# EAGLE schematic RPI (EAGLE 9.6.2)
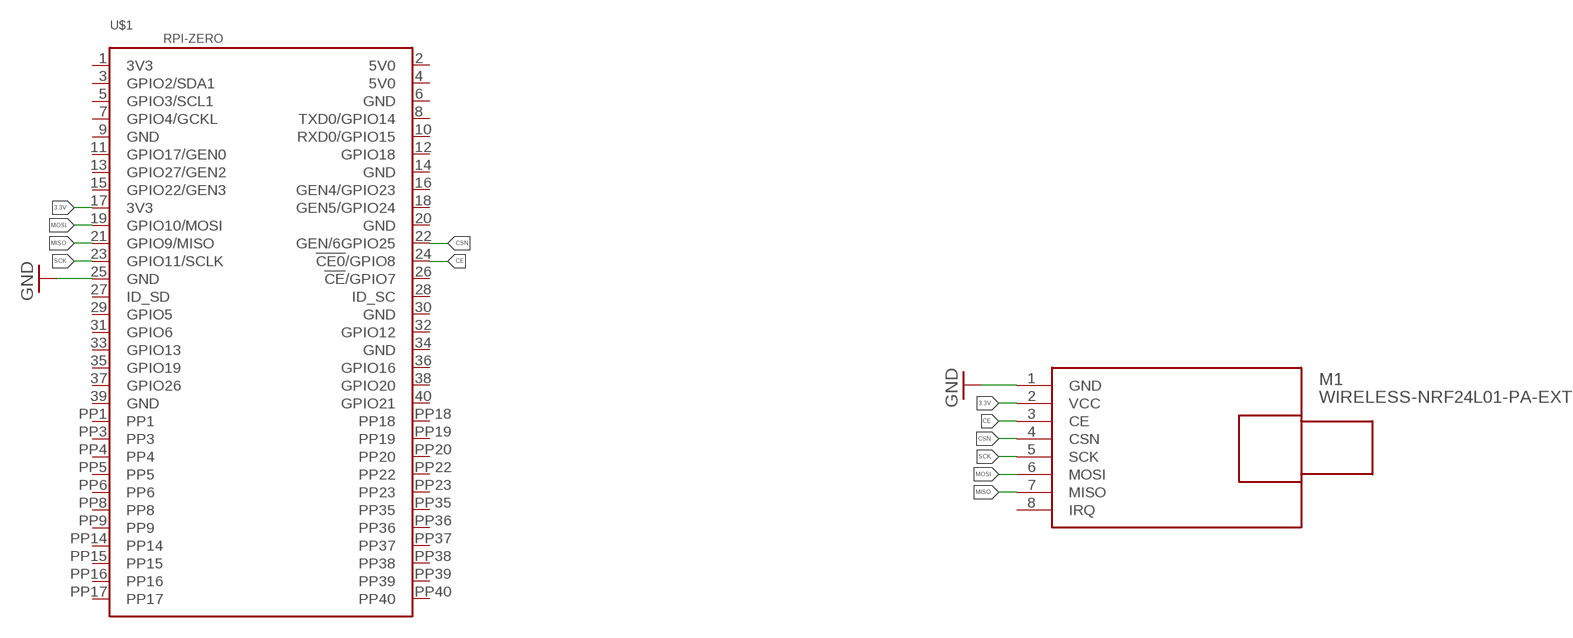
[diagram p0: schematic, sheet 1]

## Parts
M1  WIRELESS-NRF24L01-PA-EXT  [WIRELESS-NRD24L01-PA-EXT]
U$1  RPI-ZERO  [RASP_PI_ZERO_BOARD_FULL]

## Nets
3.3V: M1.2(VCC) U$1.17(3V3)
CE: M1.3(CE) U$1.24(!CE0!/GPIO8)
CSN: M1.4(CSN) U$1.22(GEN/6GPIO25)
GND: M1.1(GND) U$1.25(GND)
MISO: M1.7(MISO) U$1.21(GPIO9/MISO)
MOSI: M1.6(MOSI) U$1.19(GPIO10/MOSI)
SCK: M1.5(SCK) U$1.23(GPIO11/SCLK)
Unconnected: M1.8(IRQ) U$1.1(3V3) U$1.2(5V0) U$1.3(GPIO2/SDA1) U$1.4(5V0) U$1.5(GPIO3/SCL1) U$1.6(GND) U$1.7(GPIO4/GCKL) U$1.8(TXD0/GPIO14) U$1.9(GND) U$1.10(RXD0/GPIO15) U$1.11(GPIO17/GEN0) U$1.12(GPIO18) U$1.13(GPIO27/GEN2) U$1.14(GND) U$1.15(GPIO22/GEN3) U$1.16(GEN4/GPIO23) U$1.18(GEN5/GPIO24) U$1.20(GND) U$1.26(!CE!/GPIO7) U$1.27(ID_SD) U$1.28(ID_SC) U$1.29(GPIO5) U$1.30(GND) U$1.31(GPIO6) U$1.32(GPIO12) U$1.33(GPIO13) U$1.34(GND) U$1.35(GPIO19) U$1.36(GPIO16) U$1.37(GPIO26) U$1.38(GPIO20) U$1.39(GND) U$1.40(GPIO21) U$1.PP1 U$1.PP3 U$1.PP4 U$1.PP5 U$1.PP6 U$1.PP8 U$1.PP9 U$1.PP14 U$1.PP15 U$1.PP16 U$1.PP17 U$1.PP18 U$1.PP19 U$1.PP20 U$1.PP22 U$1.PP23 U$1.PP35 U$1.PP36 U$1.PP37 U$1.PP38 U$1.PP39 U$1.PP40

## Library data of the parts
M1 = diy-modules:WIRELESS-NRF24L01-PA-EXT: 2.4 GHz Wireless Module based on NRF24L01 chip with preamplifier and external antenna
U$1 = rpi-zero:RPI-ZERO